# EasyEDA Pro project ProPrj_ch32v305_pico.epro, board PCB1_rev2
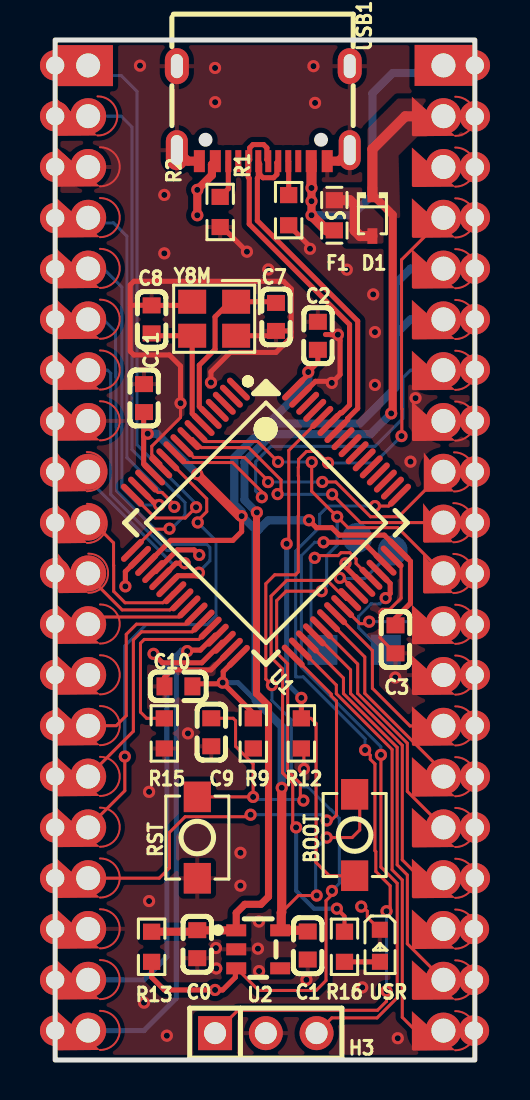
[diagram p7: board, top side]
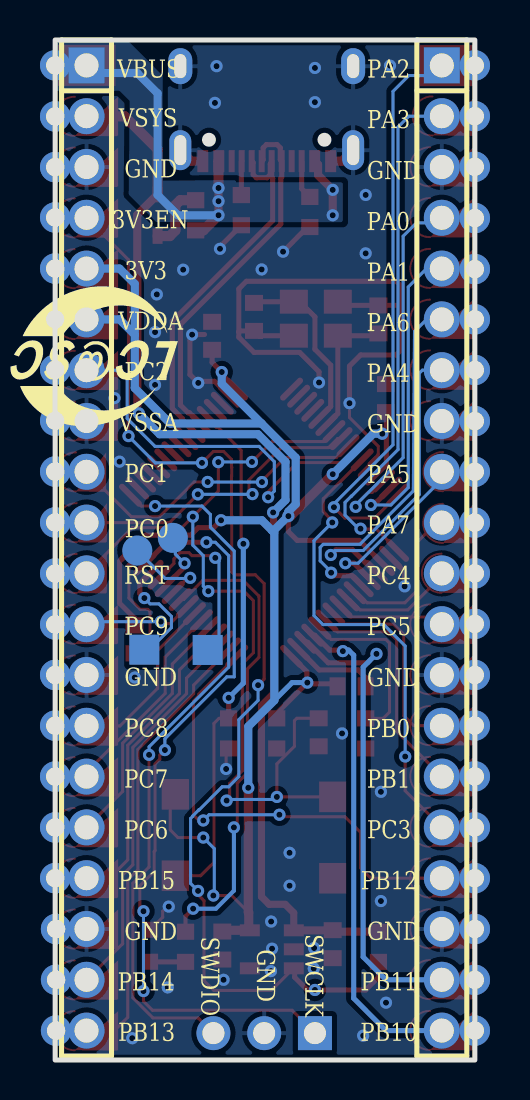
[diagram p8: board, bottom side, seen from below]

Outline 21 x 51 mm; copper layers: Top Layer, Bottom Layer. Coordinates in mm from the lower left corner of the outline.
Outline path: rectangle 0,51 21,0
Stack: Top Layer 0.035mm / Dielectric1 1.51mm FR4 er 4.5 / Bottom Layer 0.035mm

## Design rules (mm)
net D-: DP1
net D+: DP1
spacing copperThickness1oz: track to track 0.102, other pairs 0.152 to 0.3
spacing copperThickness2oz: track to track 0.203, other pairs 0.152 to 0.3
spacing nothing (default): track to track 0.102, other pairs 0 to 0.3
track width copperThickness1oz (default): min 0.127, default 0.152, max 2.54
track width copperThickness2oz: min 0.203, default 0.254, max 2.54
track width powerRail: min 0.254, default 0.406, max 2.54
differential pair differentialPair (default): width min 0.127, default 0.254, max 2.54; gap min 0.152, default 0.152
net GND uses copperRegion_copperThickness1oz, copperThickness1oz
net VSYS uses copperRegion_nothing, powerRail
net VBUS uses copperRegion_nothing, powerRail
net $1N150 uses copperRegion_nothing

## Placement (name value [footprint] x y rotation side)
BOOT  -  [Key_SMD_3x4x2]  14.99 11.25 90 top
C0  2.2uF  [C0603]  7.11 5.79 90 top
C1  2.2uF  [C0603]  12.64 5.72 90 top
C2  0.1uF  [C0603]  13.15 36.21 270 top
C3  0.1uF  [C0603]  17.03 21.03 90 top
C7  10pF  [C0603]  11.05 37.15 270 top
C8  10pF  [C0603]  4.83 37.03 270 top
C9  1uF  [C0603]  7.81 16.39 270 top
C10  0.1uF  [C0603]  6.17 18.68 0 top
C11  0.1uF  [C0603]  4.45 33.09 270 top
D1  B5819WS  [SOD-323_L1.7-W1.3-LS2.5-FD]  15.88 42.24 90 top
F1  SMD0603-050-12  [F0603]  13.97 42.24 90 top
H1  -  [HDR-TH_20P-P2.54-V-M-1]  1.65 25.6 270 bottom
H2  -  [HDR-TH_20P-P2.54-V-M-1]  19.43 25.6 270 bottom
H3  -  [HDR-TH_3P-P2.54-V-M]  10.54 1.34 0 top
NOREF  -  [Pad_e59]  21 39.57 0 top
NOREF#2  -  [Pad_e71]  1.65 31.96 0 top
NOREF#3  -  [Pad_e97]  19.43 1.46 180 top
NOREF#4  -  [Pad_e102]  19.66 26.86 180 top
NOREF#5  -  [Pad_e92]  19.43 14.16 180 top
NOREF#6  -  [Pad_e74]  1.65 19.26 0 top
NOREF#7  -  [Pad_e78]  1.65 9.1 0 top
NOREF#8  -  [Pad_e79]  1.65 6.56 0 top
NOREF#9  -  [Pad_e94]  19.43 9.08 180 top
NOREF#10  -  [Pad_e73]  1.65 21.8 0 top
NOREF#11  -  [Pad_e27]  0 42.1 0 top
NOREF#12  -  [Pad_e101]  19.7 29.4 180 top
NOREF#13  -  [Pad_e75]  1.65 16.72 0 top
NOREF#14  -  [Pad_e54]  21 26.88 0 top
NOREF#15  -  [Pad_e41]  0 6.55 0 top
NOREF#16  -  [Pad_e98]  19.43 49.73 180 top
NOREF#17  -  [Pad_e87]  19.43 34.48 180 top
NOREF#18  -  [Pad_e29]  0 37.03 0 top
NOREF#19  -  [Pad_e67]  1.65 42.12 0 top
NOREF#20  -  [Pad_e32]  0 29.41 0 top
NOREF#21  -  [Pad_e43]  0 1.47 0 top
NOREF#22  -  [Pad_e90]  19.43 19.24 180 top
NOREF#23  -  [Pad_e62]  21 47.18 0 top
NOREF#24  -  [Pad_e35]  0 21.81 0 top
NOREF#25  -  [Pad_e86]  19.43 37.02 180 top
NOREF#26  -  [Pad_e46]  20.96 6.55 0 top
NOREF#27  -  [Pad_e45]  20.96 4.01 0 top
NOREF#28  -  [Pad_e30]  0 34.5 0 top
NOREF#29  -  [Pad_e65]  1.53 47.2 0 top
NOREF#30  -  [Pad_e100]  1.4 24.34 0 top
NOREF#31  -  [Pad_e51]  21 19.25 0 top
NOREF#32  -  [Pad_e244]  13.37 20.5 0 top
NOREF#33  -  [Pad_e25]  0 47.19 0 top
NOREF#34  -  [Pad_e33]  0 26.87 0 top
NOREF#35  -  [Pad_e85]  19.43 39.56 180 top
NOREF#36  -  [Pad_e36]  0 19.25 0 top
NOREF#37  -  [Pad_e57]  21 34.52 0 top
NOREF#38  -  [Pad_e40]  0 9.09 0 top
NOREF#39  -  [Pad_e83]  19.43 44.64 180 top
NOREF#40  -  [Pad_e61]  21 44.64 0 top
NOREF#41  -  [Pad_e64]  1.45 49.72 0 top
NOREF#42  -  [Pad_e37]  0 16.72 0 top
NOREF#43  -  [Pad_e70]  1.65 34.5 0 top
NOREF#44  -  [Pad_e80]  1.65 4.02 0 top
NOREF#45  -  [Pad_e247]  16.89 25.47 0 top
NOREF#46  -  [Pad_e28]  0 39.55 0 top
NOREF#47  -  [Pad_e69]  1.65 37.04 0 top
NOREF#48  -  [Pad_e58]  21 37.04 0 top
NOREF#49  -  [Pad_e91]  19.43 16.7 180 top
NOREF#50  -  [Pad_e76]  1.65 14.18 0 top
NOREF#51  -  [Pad_e42]  0 4.01 0 top
NOREF#52  -  [Pad_e84]  19.43 42.1 180 top
NOREF#53  -  [Pad_e93]  19.43 11.62 180 top
NOREF#54  -  [Pad_e88]  19.43 31.94 180 top
NOREF#55  -  [Pad_e24]  0 49.73 0 top
NOREF#56  -  [Pad_e53]  21 24.32 0 top
NOREF#57  -  [Pad_e44]  20.96 1.47 0 top
NOREF#58  -  [Pad_e34]  0 24.33 0 top
NOREF#59  -  [Pad_e47]  21 9.09 0 top
NOREF#60  -  [Pad_e103]  19.66 24.32 180 top
NOREF#61  -  [Pad_e31]  0 31.94 0 top
NOREF#62  -  [Pad_e39]  0 11.63 0 top
NOREF#63  -  [Pad_e82]  19.43 47.18 180 top
NOREF#64  -  [Pad_e60]  21 42.13 0 top
NOREF#65  -  [Pad_e99]  1.33 26.83 0 top
NOREF#66  -  [Pad_e68]  1.65 39.58 0 top
NOREF#67  -  [Pad_e245]  16.54 20.52 0 top
NOREF#68  -  [Pad_e49]  21 14.17 0 top
NOREF#69  -  [Pad_e56]  21 31.97 0 top
NOREF#70  -  [Pad_e26]  0 44.66 0 top
NOREF#71  -  [Pad_e89]  19.43 21.78 180 top
NOREF#72  -  [Pad_e96]  19.43 4 180 top
NOREF#73  -  [Pad_e72]  1.32 29.42 0 top
NOREF#74  -  [Pad_e38]  0 14.18 0 top
NOREF#75  -  [Pad_e63]  21 49.73 0 top
NOREF#76  -  [Pad_e246]  15.11 26.11 0 top
NOREF#77  -  [Pad_e55]  21 29.42 0 top
NOREF#78  -  [Pad_e50]  21 16.72 0 top
NOREF#79  -  [Pad_e77]  1.65 11.64 0 top
NOREF#80  -  [Pad_e66]  1.65 44.66 0 top
NOREF#81  -  [Pad_e81]  1.65 1.48 0 top
NOREF#82  -  [Pad_e48]  21 11.63 0 top
NOREF#83  -  [Pad_e95]  19.43 6.54 180 top
NOREF#84  -  [Pad_e52]  21 21.78 0 top
R1  5.1k  [R0603]  11.68 42.49 270 top
R2  5.1k  [R0603]  8.26 42.4 270 top
R9  10k  [R0603]  9.91 16.33 90 top
R12  10k  [R0603]  12.32 16.33 90 top
R13  100K  [R0603]  4.83 5.66 270 top
R15  10k  [R0603]  5.46 16.33 90 top
R16  1K  [R0603]  14.48 5.66 90 top
RST  -  [Key_SMD_3x4x2]  7.11 11.12 90 top
U1  CH32V305RBT6  [LQFP-64_L10.0-W10.0-P0.50-LS12.0-BL]  10.54 26.87 225 top
U2  AP2112K-3.3TRG1  [SOT-23-5_L2.9-W1.6-P0.95-LS2.8-BR]  10.16 5.53 180 top
USB1  TYPE-C 16PIN 2MD(073)  [USB-C-SMD_TYPE-C-16PIN-2MD-073]  10.41 47.32 180 top
USR  -  [LED_0603]  16.26 5.66 270 top
Y8M  8MHz  [CRYSTAL-SMD_4P-L3.2-W2.5-BL]  7.96 37.06 180 top

## Footprints (pads in the part's own frame, mm; a bottom-side part is the same pattern mirrored in y, then rotated)
C0603
  rect 0.8x0.9 smd: 1(-0.7,0) 2(0.7,0)
CRYSTAL-SMD_4P-L3.2-W2.5-BL
  rect 1.4x1.2 smd: 1(-1.1,-0.85) 2(1.1,-0.85) 3(1.1,0.85) 4(-1.1,0.85)
F0603
  rect 0.806x0.864 smd: 1(-0.753,0) 2(0.753,0)
HDR-TH_3P-P2.54-V-M
  rect 1.7x1.7 hole 1.1: 1(-2.54,0)
  round 1.7 hole 1.1: 2(0,0) 3(2.54,0)
HDR-TH_20P-P2.54-V-M-1
  rect 1.8x1.8 hole 1.2: 1(-24.13,0)
  round 1.8 hole 1.2: 2(-21.59,0) 3(-19.05,0) 4(-16.51,0) 5(-13.97,0) 6(-11.43,0) 7(-8.89,0) 8(-6.35,0) 9(-3.81,0) 10(-1.27,0) 11(1.27,0) 12(3.81,0) 13(6.35,0) 14(8.89,0) 15(11.43,0) 16(13.97,0) 17(16.51,0) 18(19.05,0) 19(21.59,0) 20(24.13,0)
Key_SMD_3x4x2
  rect 1.53x1.36 smd: 1(-2.035,0) 2(2.035,0)
LED_0603
  rect 0.8x0.8 smd: 1(-0.851,-0.01) 2(0.75,-0.005)
LQFP-64_L10.0-W10.0-P0.50-LS12.0-BL
  oval 0.3x1.5 smd: 1(-3.75,-5.688) 2(-3.25,-5.688) 3(-2.75,-5.688) 4(-2.25,-5.688) 5(-1.75,-5.688) 6(-1.25,-5.688) 7(-0.75,-5.688) 8(-0.25,-5.688) 9(0.25,-5.688) 10(0.75,-5.688) 11(1.25,-5.688) 12(1.75,-5.688) 13(2.25,-5.688) 14(2.75,-5.688) 15(3.25,-5.688) 16(3.75,-5.688) 33(3.75,5.688) 34(3.25,5.688) 35(2.75,5.688) 36(2.25,5.688) 37(1.75,5.688) 38(1.25,5.688) 39(0.75,5.688) 40(0.25,5.688) 41(-0.25,5.688) 42(-0.75,5.688) 43(-1.25,5.688) 44(-1.75,5.688) 45(-2.25,5.688) 46(-2.75,5.688) 47(-3.25,5.688) 48(-3.75,5.688)
  oval 1.5x0.3 smd: 17(5.7,-3.738) 18(5.7,-3.238) 19(5.7,-2.738) 20(5.7,-2.238) 21(5.7,-1.738) 22(5.7,-1.238) 23(5.7,-0.739) 24(5.7,-0.238) 25(5.7,0.262) 26(5.7,0.762) 27(5.7,1.262) 28(5.7,1.762) 29(5.7,2.261) 30(5.7,2.762) 31(5.7,3.261) 32(5.7,3.762) 49(-5.7,3.762) 50(-5.7,3.261) 51(-5.7,2.762) 52(-5.7,2.261) 53(-5.7,1.762) 54(-5.7,1.262) 55(-5.7,0.762) 56(-5.7,0.262) 57(-5.7,-0.238) 58(-5.7,-0.739) 59(-5.7,-1.238) 60(-5.7,-1.738) 61(-5.7,-2.238) 62(-5.7,-2.738) 63(-5.7,-3.238) 64(-5.7,-3.738)
Pad_e24
  round 1.524 hole 0.914: 1(0,0)
Pad_e25
  round 1.524 hole 0.914: 2(0,0)
Pad_e26
  round 1.524 hole 0.914: 3(0,0)
Pad_e27
  round 1.524 hole 0.914: 4(0,0)
Pad_e28
  round 1.524 hole 0.914: 5(0,0)
Pad_e29
  round 1.524 hole 0.914: 6(0,0)
Pad_e30
  round 1.524 hole 0.914: 7(0,0)
Pad_e31
  round 1.524 hole 0.914: 8(0,0)
Pad_e32
  round 1.524 hole 0.914: 9(0,0)
Pad_e33
  round 1.524 hole 0.914: 10(0,0)
Pad_e34
  round 1.524 hole 0.914: 11(0,0)
Pad_e35
  round 1.524 hole 0.914: 12(0,0)
Pad_e36
  round 1.524 hole 0.914: 13(0,0)
Pad_e37
  round 1.524 hole 0.914: 14(0,0)
Pad_e38
  round 1.524 hole 0.914: 15(0,0)
Pad_e39
  round 1.524 hole 0.914: 16(0,0)
Pad_e40
  round 1.524 hole 0.914: 17(0,0)
Pad_e41
  round 1.524 hole 0.914: 18(0,0)
Pad_e42
  round 1.524 hole 0.914: 19(0,0)
Pad_e43
  round 1.524 hole 0.914: 20(0,0)
Pad_e44
  round 1.524 hole 0.914: 1(0,0)
Pad_e45
  round 1.524 hole 0.914: 2(0,0)
Pad_e46
  round 1.524 hole 0.914: 3(0,0)
Pad_e47
  round 1.524 hole 0.914: 1(0,0)
Pad_e48
  round 1.524 hole 0.914: 2(0,0)
Pad_e49
  round 1.524 hole 0.914: 3(0,0)
Pad_e50
  round 1.524 hole 0.914: 4(0,0)
Pad_e51
  round 1.524 hole 0.914: 5(0,0)
Pad_e52
  round 1.524 hole 0.914: 6(0,0)
Pad_e53
  round 1.524 hole 0.914: 7(0,0)
Pad_e54
  round 1.524 hole 0.914: 8(0,0)
Pad_e55
  round 1.524 hole 0.914: 9(0,0)
Pad_e56
  round 1.524 hole 0.914: 10(0,0)
Pad_e57
  round 1.524 hole 0.914: 11(0,0)
Pad_e58
  round 1.524 hole 0.914: 12(0,0)
Pad_e59
  round 1.524 hole 0.914: 13(0,0)
Pad_e60
  round 1.524 hole 0.914: 14(0,0)
Pad_e61
  round 1.524 hole 0.914: 15(0,0)
Pad_e62
  round 1.524 hole 0.914: 16(0,0)
Pad_e63
  round 1.524 hole 0.914: 17(0,0)
Pad_e64
  custom 2.891x2.05 smd: 65(0,0)
Pad_e65
  custom 3.159x1.975 smd: 66(0,0)
Pad_e66
  custom 3.158x1.975 smd: 66(0,0)
Pad_e67
  custom 3.158x1.975 smd: 66(0,0)
Pad_e68
  custom 3.158x1.975 smd: 66(0,0)
Pad_e69
  custom 3.158x1.975 smd: 66(0,0)
Pad_e70
  custom 3.158x1.975 smd: 66(0,0)
Pad_e71
  custom 3.158x1.975 smd: 66(0,0)
Pad_e72
  custom 2.502x1.975 smd: 66(0,0)
Pad_e73
  custom 3.158x1.975 smd: 66(0,0)
Pad_e74
  custom 3.158x1.975 smd: 66(0,0)
Pad_e75
  custom 3.158x1.975 smd: 66(0,0)
Pad_e76
  custom 3.158x1.975 smd: 66(0,0)
Pad_e77
  custom 3.158x1.975 smd: 66(0,0)
Pad_e78
  custom 3.158x1.975 smd: 66(0,0)
Pad_e79
  custom 3.158x1.975 smd: 66(0,0)
Pad_e80
  custom 3.158x1.975 smd: 66(0,0)
Pad_e81
  custom 3.158x1.975 smd: 66(0,0)
Pad_e82
  custom 3.158x1.975 smd: 66(0,0)
Pad_e83
  custom 3.158x1.975 smd: 66(0,0)
Pad_e84
  custom 3.158x1.975 smd: 66(0,0)
Pad_e85
  custom 3.158x1.975 smd: 66(0,0)
Pad_e86
  custom 3.158x1.975 smd: 66(0,0)
Pad_e87
  custom 3.158x1.975 smd: 66(0,0)
Pad_e88
  custom 3.158x1.975 smd: 66(0,0)
Pad_e89
  custom 3.158x1.975 smd: 66(0,0)
Pad_e90
  custom 3.158x1.975 smd: 66(0,0)
Pad_e91
  custom 3.158x1.975 smd: 66(0,0)
Pad_e92
  custom 3.158x1.975 smd: 66(0,0)
Pad_e93
  custom 3.158x1.975 smd: 66(0,0)
Pad_e94
  custom 3.158x1.975 smd: 66(0,0)
Pad_e95
  custom 3.158x1.975 smd: 66(0,0)
Pad_e96
  custom 3.158x1.975 smd: 66(0,0)
Pad_e97
  custom 3.158x1.975 smd: 66(0,0)
Pad_e98
  custom 2.892x2.051 smd: 65(0,0)
Pad_e99
  custom 2.502x1.975 smd: 66(0,0)
Pad_e100
  custom 2.502x1.975 smd: 66(0,0)
Pad_e101
  custom 2.502x1.975 smd: 66(0,0)
Pad_e102
  custom 2.502x1.975 smd: 66(0,0)
Pad_e103
  custom 2.502x1.975 smd: 66(0,0)
Pad_e244
  rect 1.5x1.5 smd far side: TP6(0,0)
Pad_e245
  rect 1.5x1.5 smd far side: TP7(0,0)
Pad_e246
  round 1.5 smd far side: TP9(0,0)
Pad_e247
  round 1.5 smd far side: TP10(0,0)
R0603
  rect 0.806x0.864 smd: 1(-0.753,0) 2(0.753,0)
SOD-323_L1.7-W1.3-LS2.5-FD
  rect 0.78x0.5 smd: 1(-1.04,0) 2(1.04,0)
SOT-23-5_L2.9-W1.6-P0.95-LS2.8-BR
  rect 1x0.6 smd: 1(1.1,-0.95) 2(1.1,0) 3(1.1,0.95) 4(-1.1,0.95) 5(-1.1,-0.95)
USB-C-SMD_TYPE-C-16PIN-2MD-073
  oval 1.1x2 hole 0.6x1.5: 13(-4.325,1.825) 14(4.325,1.825)
  oval 1.2x1.8 hole 0.6x1.2: 13(-4.325,-2.375) 14(4.325,-2.375)
  rect 0.55x1.1 smd: A1B12(-3.2,2.375) A4B9(-2.4,2.375) B1A12(3.2,2.375) B4A9(2.4,2.375)
  rect 0.3x1.1 smd: A5(-1.25,2.375) A6(-0.25,2.375) A7(0.25,2.375) A8(1.25,2.375) B5(1.75,2.375) B6(0.75,2.375) B7(-0.75,2.375) B8(-1.75,2.375)

## Nets
3V3_EN: H2.4 NOREF#52.66 NOREF#64.14 R13.2 U2.3
+3.3V: BOOT.2 C1.2 C2.2 C3.2 C10.2 C11.2 H2.5 H2.6 NOREF.13 NOREF#25.66 NOREF#35.66 NOREF#48.12 R9.2 U1.13 U1.19 U1.32 U1.48 U1.64 U2.5
GND: C0.1 C1.1 C2.1 C3.1 C7.2 C8.1 C9.2 C10.1 C11.1 H1.3 H1.8 H1.13 H1.18 H2.3 H2.8 H2.13 H2.18 H3.2 NOREF#2.66 NOREF#6.66 NOREF#8.66 NOREF#15.18 NOREF#22.66 NOREF#26.3 NOREF#31.5 NOREF#36.13 NOREF#39.66 NOREF#40.15 NOREF#54.66 NOREF#61.8 NOREF#69.10 NOREF#70.3 NOREF#80.66 NOREF#83.66 R1.2 R2.2 R12.1 R15.1 RST.1 U1.12 U1.18 U1.31 U1.47 U1.63 U2.2 USB1.13 USB1.14 USB1.A1B12 USB1.B1A12 USR.1 Y8M.2 Y8M.4
VBUS: F1.1 H2.1 NOREF#16.65 NOREF#75.17 USB1.A4B9 USB1.B4A9
BOOT0: BOOT.1 R12.2 U1.60
D+: U1.59 USB1.A6 USB1.B6
D-: U1.58 USB1.A7 USB1.B7
OSC_IN: C7.1 U1.5 Y8M.1
OSC_OUT: C8.2 U1.6 Y8M.3
PA0: H1.4 NOREF#11.4 NOREF#19.66 U1.14
PA1: H1.5 NOREF#46.5 NOREF#66.66 U1.15
PA2: H1.1 NOREF#41.65 NOREF#55.1 U1.16
PA3: H1.2 NOREF#29.66 NOREF#33.2 U1.17
PA4: H1.7 NOREF#28.7 NOREF#43.66 U1.20
PA5: H1.9 NOREF#20.9 NOREF#73.66 U1.21
PA6: H1.6 NOREF#18.6 NOREF#47.66 U1.22
PA7: H1.10 NOREF#34.10 NOREF#65.66 U1.23
PA8: R16.2 U1.41
PA9: NOREF#45.TP10 U1.42
PA10: NOREF#76.TP9 U1.43
PA15: U1.50
PB0: H1.14 NOREF#13.66 NOREF#42.14 U1.26
PB1: H1.15 NOREF#50.66 NOREF#74.15 U1.27
PB2: R15.2 U1.28
PB3: U1.55
PB4: U1.56
PB5: U1.57
PB8: U1.61
PB9: U1.62
PB10: H1.20 NOREF#21.20 NOREF#81.66 U1.29
PB11: H1.19 NOREF#44.66 NOREF#51.19 U1.30
PB12: H1.17 NOREF#7.66 NOREF#38.17 U1.33
PB13: H2.20 NOREF#3.66 NOREF#57.1 U1.34
PB14: H2.19 NOREF#27.2 NOREF#72.66 U1.35
PB15: H2.17 NOREF#9.66 NOREF#59.1 U1.36
PC0: H2.10 NOREF#4.66 NOREF#14.8 U1.8
PC1: H2.9 NOREF#12.66 NOREF#77.9 U1.9
PC2: H2.7 NOREF#17.66 NOREF#37.11 U1.10
PC3: H1.16 NOREF#62.16 NOREF#79.66 U1.11
PC4: H1.11 NOREF#30.66 NOREF#58.11 U1.24
PC5: H1.12 NOREF#10.66 NOREF#24.12 U1.25
PC6: H2.16 NOREF#53.66 NOREF#82.2 U1.37
PC7: H2.15 NOREF#5.66 NOREF#68.3 U1.38
PC8: H2.14 NOREF#49.66 NOREF#78.4 U1.39
PC9: H2.12 NOREF#71.66 NOREF#84.6 U1.40
PC10: U1.51
PC11: U1.52
PC12: U1.53
PC13: U1.2
PC14: U1.3
PC15: U1.4
PD2: U1.54
SWCLK: H3.1 U1.49
SWDIO: H3.3 U1.46
SYS_RST: C9.1 H2.11 NOREF#56.7 NOREF#60.66 R9.1 RST.2 U1.7
USB1DM: NOREF#32.TP6 U1.44
USB1DP: NOREF#67.TP7 U1.45
VSYS: C0.2 D1.2 H2.2 NOREF#23.16 NOREF#63.66 R13.1 U2.1
$1N10: R1.1 USB1.A5
$1N11: R2.1 USB1.B5
$1N150: D1.1 F1.2
$1N168: R16.1 USR.2

Pads without a net: U1 1; U2 4; USB1 A8 B8

## Via types
v1: diameter 0.61, hole 0.305, Top Layer to Bottom Layer, 99 vias

## Routing (per net, layer and track width the routed paths; a pad name or vN(x,y) marks a point on that pad's centre or on a via; arc(x,y) is an arc through that point)
3V3_EN: length 58.4
  Top Layer w0.152: v1(13.65,29.86) 13.09,30.43 12.57,30.43 12.18,30.03 12.18,29.65 12.17,29.64 12.17,29.2 12.18,29.19 12.18,27.23 12.17,27.22 12.17,24.4 12.03,24.26 10.99,24.26 10.54,23.81 10.54,19.05 v1(10.85,18.74) ; U2.3 9.08,4.58 10.19,3.48 13.06,3.48 13.55,3.97 13.55,7.97 13.85,8.26 v1(13.85,8.45) ; H2.4 17.33,40.01 17.33,32.57 17.35,32.55 17.35,31.21 v1(17.33,31.2)
  Top Layer w0.254: U2.3 9.02,4.54 9.02,4.14 8.38,3.5 v1(8,3.5) 5.46,3.5 4.83,4.14 R13.2
  Bottom Layer w0.152: v1(17.33,31.2) 15.99,29.86 v1(13.65,29.86) ; v1(10.85,18.74) 10.85,17.98 11.81,17.02 11.81,14.17 12.32,13.66 12.64,13.66 13.79,12.51 13.81,12.51 14.12,12.2 14.12,12.18 14.22,12.08 14.22,8.83 v1(13.85,8.45)
+3.3V: length 97.4
  Top Layer w0.152: v1(13.59,11.12) 14.86,11.12 15.24,11.5 15.24,13.16 15.11,13.28 ; 13.04,8.22 12.17,8.22 11.31,7.37
  Top Layer w0.254: 4.44,32.39 4.43,32.38 4.43,31.18 ; U1.19 5.78,25.98 8.89,25.98 9.33,26.42 v1(9.33,27.19) ; v1(8.38,18.87) 8.44,18.81 ; 8.44,18.81 10.04,17.21 10.04,17.08 10.17,17.08 ; 8.44,18.81 6.87,18.81 ; 4.43,31.18 4.43,29.8 4.93,29.3 ; 4.43,31.18 4.5,31.18 v1(4.63,31.31) ; C3.2 17.03,22.09 17.78,22.84 17.78,24.93 16.47,26.24 14.22,26.24 13.84,26.62 13.07,26.62 v1(12.7,26.99) ; 8.44,18.81 8.41,18.84 8.41,19.42 U1.32 ; U1.64 12.66,34.28 v1(12.66,34.4) 13.15,34.88 C2.2
  Top Layer w0.457: v1(7.11,29.29) 9.21,27.19 v1(9.33,27.19) ; C1.2 12.58,6.48 U2.5 11.31,6.54 11.31,7.37 11.34,7.39 v1(11.34,13.61)
  Bottom Layer w0.152: v1(13.59,11.12) 13.04,10.57 13.04,8.22
  Bottom Layer w0.254: v1(8.38,18.87) 9.14,18.87 10.03,17.98
  Bottom Layer w0.406: v1(11.34,13.61) 11.34,16.68 10.03,17.98 10.03,26.36 10.16,26.49 ; 10.16,26.49 10.05,26.49 9.34,27.19 v1(9.33,27.19) 9.33,27.42 8.96,27.79 8.96,30.12 10.67,31.83 ; 10.16,26.49 10.66,26.99 v1(12.7,26.99) ; H2.6 17.78,37.03 17.02,36.27 ; 17.02,36.27 17.02,33.6 15.24,31.83 10.67,31.83 ; 17.02,36.27 17.02,38.81 17.78,39.57 H2.5 ; v1(7.11,29.29) 5.09,31.31 v1(4.63,31.31) ; 10.67,31.83 12.66,33.82 v1(12.66,34.4)
  vias: v1(13.09,8.22)
GND: length 60
  Top Layer w0.152: v1(6.27,32.84) 6.27,32.13 4.83,30.69 4.83,30.28 5.28,29.83 U1.12 ; 16.86,25.15 17.31,24.7 17.31,23.1 16.75,22.53 16.36,22.53 16.26,22.42 16.26,21.11 C3.1 ; USR.1 15.62,7.14 15.62,7.44 15.39,7.67 v1(15.32,7.67) ; R12.1 12.45,15.45 v1(12.45,14.55)
  Top Layer w0.254: 3.76,37.74 3.76,35.43 3.94,35.25 5.72,35.25 6.27,34.69 v1(6.27,32.84) ; 3.76,37.74 4.82,37.74 C8.1 6.67,37.73 Y8M.2 ; 3.76,37.74 3.76,38.76 3.94,38.94 11.43,38.94 11.81,38.55 11.81,36.41 ; 11.81,36.41 11.81,36.14 11.05,35.38 8.76,35.38 7.8,34.41 v1(7.8,33.87) ; 11.81,36.41 11.76,36.45 C7.2 10.81,36.21 9.06,36.21 ; v1(12.75,40.56) 12.75,40.67 R1.2 ; R2.2 8.36,41.65 v1(9.6,40.42) ; 13.53,36.27 13.96,36.27 14.26,35.98 14.26,34.27 v1(13.84,33.86) 13.76,33.93 13.03,33.93 U1.63 ; v1(3.51,23.68) 3.51,24.42 4.22,25.13 ; C10.1 5.47,19.13 5.84,19.5 7.79,19.5 8.82,20.53
  Top Layer w0.457: 14.74,45.49 14.19,44.94 USB1.A1B12 ; USB1.14 6.64,44.94 USB1.B1A12
  vias: v1(4.24,49.72) v1(4.44,2.87) v1(4.7,13.41) v1(4.7,7.95) v1(5.46,43.25) v1(5.46,40.33) v1(5.59,1.22) v1(6.65,16.33) v1(8,49.6) v1(8,47.89) v1(8.04,5.6) v1(8.06,4.58) v1(9.27,10.36) v1(9.27,8.71) v1(10.15,5.57) v1(10.19,6.92) v1(10.2,4.45) v1(10.67,39.53) v1(12.57,4.01) v1(12.92,49.69) v1(13.01,47.86) v1(14.15,36.27) v1(14.6,39.52) v1(15.37,3.63) v1(15.91,38.28) v1(16,36.39) v1(16,33.75) v1(17.02,19.12) v1(17.15,1.09) v1(17.78,29.92) v1(18.03,33.09)
VBUS: length 19.9
  Top Layer w0.406: v1(12.83,42.24) v1(12.83,42.94) v1(12.83,43.6) ; v1(7.11,42.24) v1(7.11,43.51) 7.11,43.51 7.84,44.25 7.84,44.77 USB1.B4A9
  Top Layer w0.508: USB1.A4B9 12.83,44.93 v1(12.83,43.6) ; F1.1 13.58,41.48 v1(12.83,42.24)
  Bottom Layer w0.406: v1(12.83,42.24) 14.86,42.24 15.88,43.25 15.88,48.33 16.89,49.35 19.05,49.35 NOREF#16.65
BOOT0: length 26.2
  Top Layer w0.152: v1(11.58,25.81) 11.69,25.92 11.69,30.48 U1.60 ; R12.2 12.8,17.08 13.06,16.83 13.06,9.88 13.72,9.21 15.11,9.21
  Top Layer w0.254: R12.2 v1(12.32,18.11)
  Bottom Layer w0.254: v1(12.32,18.11) 11.58,18.84 v1(11.58,25.81)
D+: length 18.1
  Top Layer w0.254: USB1.A6 10.59,45.01 10.59,45.61 10.43,45.77 9.9,45.77 9.74,45.61 9.74,45.01 USB1.B6 9.66,44.14 9.71,44.09 9.71,41.8 14.73,36.78 14.73,32.75 14.35,32.36 14.28,32.36 U1.59
D-: length 18.5
  Top Layer w0.254: U1.58 14.63,32.01 14.63,32.07 15.14,32.58 15.14,36.94 10.12,41.97 10.12,44.09 10.16,44.14 USB1.A7 10.19,44.92 10.19,44.84 10.24,44.8 10.24,44.28 10.4,44.11 10.93,44.11 11.09,44.28 11.09,44.87 USB1.B7
OSC_IN: length 9
  Top Layer w0.254: U1.5 7.21,32.67 7.21,34.74 8,35.53 8,37.16 8.76,37.91 Y8M.1 10.99,37.91 C7.1
OSC_OUT: length 6.7
  Top Layer w0.254: U1.6 6.86,32.32 6.86,36.21 4.94,36.21 C8.2
PA0: length 18.8
  Top Layer w0.152: U1.14 5.14,28.38 5.35,28.38 5.96,27.77 v1(5.96,27.66)
  Bottom Layer w0.152: v1(5.96,27.66) 5.96,27.74 3.59,30.12 3.59,41.19 2.92,41.86 1.91,41.86 H1.4
PA1: length 15.6
  Top Layer w0.254: v1(5.2,27.75) 5.07,27.89 4.93,27.89 U1.15
  Bottom Layer w0.152: v1(5.2,27.75) 4.2,27.75 3.33,28.62 3.33,38.65 2.41,39.57 H1.5
PA2: length 28.9
  Top Layer w0.152: U1.16 5.01,27.1 6.51,27.1 v1(7.05,27.64)
  Bottom Layer w0.152: v1(7.05,27.64) 6.99,27.7 6.99,27.87 4.1,30.76 4.1,48.43 3.3,49.22 2.16,49.22 H1.1
PA3: length 26.3
  Top Layer w0.152: v1(5.72,26.57) 5.69,26.54 4.92,26.54 3.87,25.48
  Bottom Layer w0.152: H1.2 3.3,47.19 3.84,46.65 3.84,30.52 6.17,28.19 6.18,28.19 6.5,27.88 6.5,27.24 5.82,26.57 v1(5.72,26.57)
PA4: length 15.8
  Top Layer w0.254: v1(7.21,25.25) 6.95,25.5 6.11,25.5 5.03,24.42 U1.20
  Bottom Layer w0.152: v1(7.21,25.25) 6.99,25.47 5.59,25.47 2.78,28.28 2.78,34.34 2.63,34.49 H1.7
PA5: length 8.5
  Top Layer w0.254: v1(6.48,24.84) 6.05,24.84 U1.21
  Bottom Layer w0.152: v1(6.48,24.84) 5.84,24.84 1.65,29.03 H1.9
PA6: length 18.8
  Top Layer w0.254: v1(7.19,24.37) 7.04,24.22 6.13,24.22 5.63,23.72
  Bottom Layer w0.152: v1(7.19,24.37) 7.19,24.41 7.74,24.96 7.74,25.63 7.59,25.78 5.75,25.78 3.08,28.45 3.02,36.42 2.29,37.16 1.78,37.16 H1.6
PA7: length 7.6
  Top Layer w0.152: U1.23 5.89,23.36 5.39,22.86 3.5,22.86 2.93,23.43 2.93,24.73 2.92,24.73 2.92,25.85 1.91,26.87 H1.10
PA8: length 23.6
  Top Layer w0.152: v1(12.06,11.63) 11.89,11.8 11.89,13.85 11.38,14.36 11.38,19.56 10.8,20.13 10.8,23.2 11.59,23.98 13.61,23.98 14.57,23.02 U1.41
  Top Layer w0.203: v1(14.1,7.57) 14.48,7.19 R16.2
  Bottom Layer w0.203: v1(14.1,7.57) 12.95,7.57 12.06,8.46 v1(12.06,11.63)
PA9: length 3.8
  Top Layer w0.152: v1(14.25,24.11) 14.36,24.11 U1.42
  Bottom Layer w0.152: 16.38,25.09 16.38,24.97 15.49,24.08 14.28,24.08 v1(14.25,24.11)
PA10: length 2.9
  Top Layer w0.254: v1(14.53,24.83) 14.53,24.65 15.45,23.73
  Bottom Layer w0.152: v1(14.53,24.83) 14.99,25.29 14.99,26.11
PB0: length 10.1
  Top Layer w0.152: 7.05,22.3 6.54,21.79 4.06,21.79 3.56,21.28 3.56,17.22 3.06,16.72 NOREF#13.66
PB1: length 11.6
  Top Layer w0.152: U1.27 6.86,21.41 4.32,21.41 3.91,21 3.91,16.44 NOREF#50.66
PB2: length 8.6
  Top Layer w0.152: U1.28 7.19,21.03 4.46,21.03 4.27,20.84 4.27,17.39 4.58,17.08 R15.2
PB10: length 24.7
  Top Layer w0.254: U1.29 8.01,21.24 7.26,20.5 6.6,20.5
  Bottom Layer w0.254: H1.20 4.44,1.47 6.06,3.09 6.06,20.24 6.31,20.5 6.6,20.5
  vias: v1(6.6,20.44)
PB11: length 24
  Top Layer w0.254: v1(4.92,20.31) 5.37,19.86 7.34,19.86 8.36,20.89 U1.30
  Bottom Layer w0.254: v1(4.92,20.31) 5.59,19.64 5.59,5.15 4.44,4.01 H1.19
PB12: length 23.9
  Top Layer w0.152: v1(13.59,11.98) 13.81,11.98 14.08,12.25 14.08,17.95 13.82,18.21 13.82,18.29 U1.33 ; v1(9.78,12.26) 9.68,12.16 6.5,12.16 5.72,11.38 5.72,9.6 5.21,9.09 H1.17
  Bottom Layer w0.152: v1(9.78,12.26) 13.3,12.26 v1(13.59,11.98)
PB13: length 22.9
  Top Layer w0.152: U1.34 14.07,18.75 14.07,18.32 16.86,15.53 16.86,9.51 17.37,9 17.37,2.13 18.04,1.46 NOREF#3.66
PB14: length 19.7
  Top Layer w0.152: U1.35 14.43,19.1 14.43,18.32 17.12,15.63 17.12,9.76 17.62,9.25 17.62,5.81 NOREF#72.66
PB15: length 15.5
  Top Layer w0.152: U1.36 13.03,21.26 14.78,19.5 14.78,18.32 17.37,15.74 17.37,10.01 18.29,9.08 NOREF#9.66
PC0: length 15.1
  Top Layer w0.152: U1.8 6.87,31.07 7.32,30.62 9.68,30.62 11.3,29 11.3,28.47 v1(11.13,28.3) ; H2.10 15.27,26.87 v1(13.86,28.28)
  Bottom Layer w0.152: v1(11.13,28.3) 11.14,28.28 v1(13.86,28.28)
PC1: length 15.5
  Top Layer w0.152: 10.71,28.9 9.48,30.13 6.93,30.13 U1.9 ; H2.9 17.18,27.16 15.78,27.16 14.04,28.9 v1(13.37,28.9)
  Bottom Layer w0.152: v1(10.65,28.9) 13.36,28.9 v1(13.37,28.9)
PC2: length 19.8
  Top Layer w0.152: U1.10 6.48,29.87 8.88,29.87 10.34,28.41 v1(10.34,28.14)
  Bottom Layer w0.152: v1(10.34,28.14) 10.03,28.45 10.03,29.92 10.79,30.68 16,30.68 17.4,32.08 17.4,34.11 17.78,34.49 H2.7
PC3: length 24.2
  Top Layer w0.152: H1.16 3.48,13.46 v1(3.48,15.17) ; v1(7.13,26.88) 7.13,26.97 7.58,27.42 7.58,28.06 U1.11
  Bottom Layer w0.152: v1(7.13,26.88) 8.05,25.96 8.05,22.22 7.6,21.77 4.55,21.77 3.48,20.7 v1(3.48,15.17)
PC4: length 5.7
  Top Layer w0.152: H1.11 1.65,24.21 3.35,22.51 5.74,22.51 6.24,23.01 U1.24
PC5: length 5.4
  Top Layer w0.152: U1.25 6.19,22.15 2,22.15 NOREF#10.66
PC6: length 12.5
  Top Layer w0.152: U1.37 15.14,19.8 15.14,18.33 17.62,15.84 17.62,13.43 NOREF#53.66
PC7: length 10.2
  Top Layer w0.152: H2.15 19.43,14.39 15.49,18.33 15.49,20.15 U1.38
PC8: length 8.8
  Top Layer w0.152: NOREF#49.66 17.76,16.7 15.88,18.58 15.88,20.48 U1.39
PC9: length 5.5
  Top Layer w0.152: U1.40 15.24,21.82 15.62,21.82 v1(15.72,21.92)
  Bottom Layer w0.152: v1(15.72,21.92) 19.3,21.92 H2.12
SWCLK: length 40.7
  Top Layer w0.152: v1(16,27.7) 16.69,27.7 U1.49 ; v1(16.58,3.45) 16.58,2.94 16.13,2.49 9.14,2.49 H3.1 ; v1(16.58,7.44) 16.76,7.62 16.76,8.71 16.05,9.43 16.05,10.42 16,10.47 16,14.8 15.77,15.04 15.77,15.24 v1(15.51,15.5)
  Bottom Layer w0.152: v1(15.51,15.5) 15.51,16.06 12.41,19.16 12.04,19.16 12.04,25.45 13.23,26.64 13.23,27.28 13.65,27.7 v1(16,27.7) ; v1(16.58,7.44) v1(16.58,3.45)
SWDIO: length 33.8
  Top Layer w0.152: v1(16.3,15.26) 16.3,9.65 17.12,8.84 17.12,3.11 16.11,2.1 13.84,2.1 H3.3
  Top Layer w0.254: v1(13.43,25.89) 15.41,25.89 U1.46
  Bottom Layer w0.152: v1(16.3,15.26) 16.3,15.66 12.32,19.64 12.32,25.22 12.99,25.89 v1(13.43,25.89)
SYS_RST: length 43.9
  Top Layer w0.152: v1(12.42,12.97) 12.27,13.12 12.27,13.83 11.63,14.46 11.63,19.81 11.08,20.36 11.08,22.97 11.56,23.44 v1(13.34,23.44) ; RST.2 9.9,13.16 v1(9.91,13.15) 9.91,14.81 9.03,15.68 9.03,16.96 8.91,17.09 7.94,17.09 ; 7.05,31.42 7.55,30.92 10.13,30.92 v1(11.15,29.9) ; H2.11 17.15,26.62 14.66,26.62 v1(14.11,27.16) 12.84,28.44 v1(12.84,29.89)
  Bottom Layer w0.152: v1(13.34,23.44) 13.59,23.69 13.59,25.22 14.11,25.74 v1(14.11,27.16) ; v1(9.91,13.15) 10.03,13.03 12.37,13.03 v1(12.42,12.97) ; v1(11.15,29.9) 12.82,29.9 v1(12.84,29.89)
USB1DM: length 8.7
  Top Layer w0.152: v1(12.99,25.11) 13.1,25.11 13.21,25.22 14.16,25.22 14.31,25.37 14.75,25.37 15.06,25.06 15.06,24.83 U1.44
  Bottom Layer w0.152: v1(12.99,25.11) 12.8,24.92 12.8,21.18 13.59,20.39
USB1DP: length 5.6
  Top Layer w0.254: v1(16.54,23.1) 16.76,23.32 16.76,23.83 16.15,24.44
  Bottom Layer w0.152: 16.4,20.61 16.19,20.61 15.18,21.62 15.18,22.18 15.81,22.81 16.25,22.81 v1(16.54,23.1)
VSYS: length 55.6
  Top Layer w0.355: v1(10.09,27.38) 10.07,27.36 10.07,18.32 10.68,17.72 10.68,8.17 10.29,7.78 9.49,7.78 9.06,7.36 U2.1
  Top Layer w0.406: v1(16.81,32.33) 16.89,32.41 16.89,42.26 D1.2 ; U2.1 7.11,6.48 ; R13.1 7.04,6.41 C0.2
  Top Layer w0.508: D1.2 15.88,45.54 17.52,47.18 NOREF#63.66
  Bottom Layer w0.406: v1(16.81,32.33) 15.77,31.29 10.85,31.29 9.47,29.91 9.47,28 v1(10.09,27.38)
$1N10: length 1.7
  Top Layer w0.254: R1.1 11.68,44.92 USB1.A5
$1N11: length 2
  Top Layer w0.254: USB1.B5 8.66,43.56 R2.1
$1N150: length 3.4
  Top Layer w0.508: D1.1 15.26,41.2 14.99,41.47 14.99,42.75 14.74,42.99 F1.2
$1N168: length 1.8
  Top Layer w0.254: R16.1 16.25,4.91 USR.2

## Copper pours and planes (outline as drawn; the poured copper is in the pictures)
GND on Top Layer: 0,50.87 21,50.87 21,-0.13 0,-0.13
GND on Bottom Layer: 0,50.75 21,50.75 21,-0.25 0,-0.25
VBUS on Bottom Layer: 17.4,51 21,51 21,48.46 17.78,48.46 17.27,47.95 17.32,43.27 15.95,41.9 11.94,41.9 11.94,43.99 15.62,43.97 15.62,49.22
VBUS on Bottom Layer: 6.6,43.89 13.17,43.89 13.17,41.89 6.6,41.89
VSYS on Top Layer: 21,48.23 21,46.17 18.14,46.17 17.19,45.22 17.27,41.98 15.88,43.02 15.62,43.28 15.62,46.56 17.15,48.08 20.85,48.08
$1N150 on Top Layer: 13.23,43.63 16.64,43.63 16.64,40.71 16.53,40.82 14.6,40.82 14.6,42.03 14.3,42.33 13.23,42.33

## Text on the board
Bottom Silkscreen Layer: PA2 | PA3 | GND | PC3 | PA5 | PC5 | PA1 | PB1 | PA7 | PA0 | PA6 | PB0 | PA4 | PC4 | PB12 | PB11 | PB10 | PC0 | 3V3 | PC2 | PC8 | PC1 | PC9 | PC7 | RST | PC6 | VSYS | VDDA | VSSA | PB13 | PB15 | PB14 | VBUS | 3V3EN | SWCLK | SWDIO
